# EAGLE design display-i2c (EAGLE 4.13)
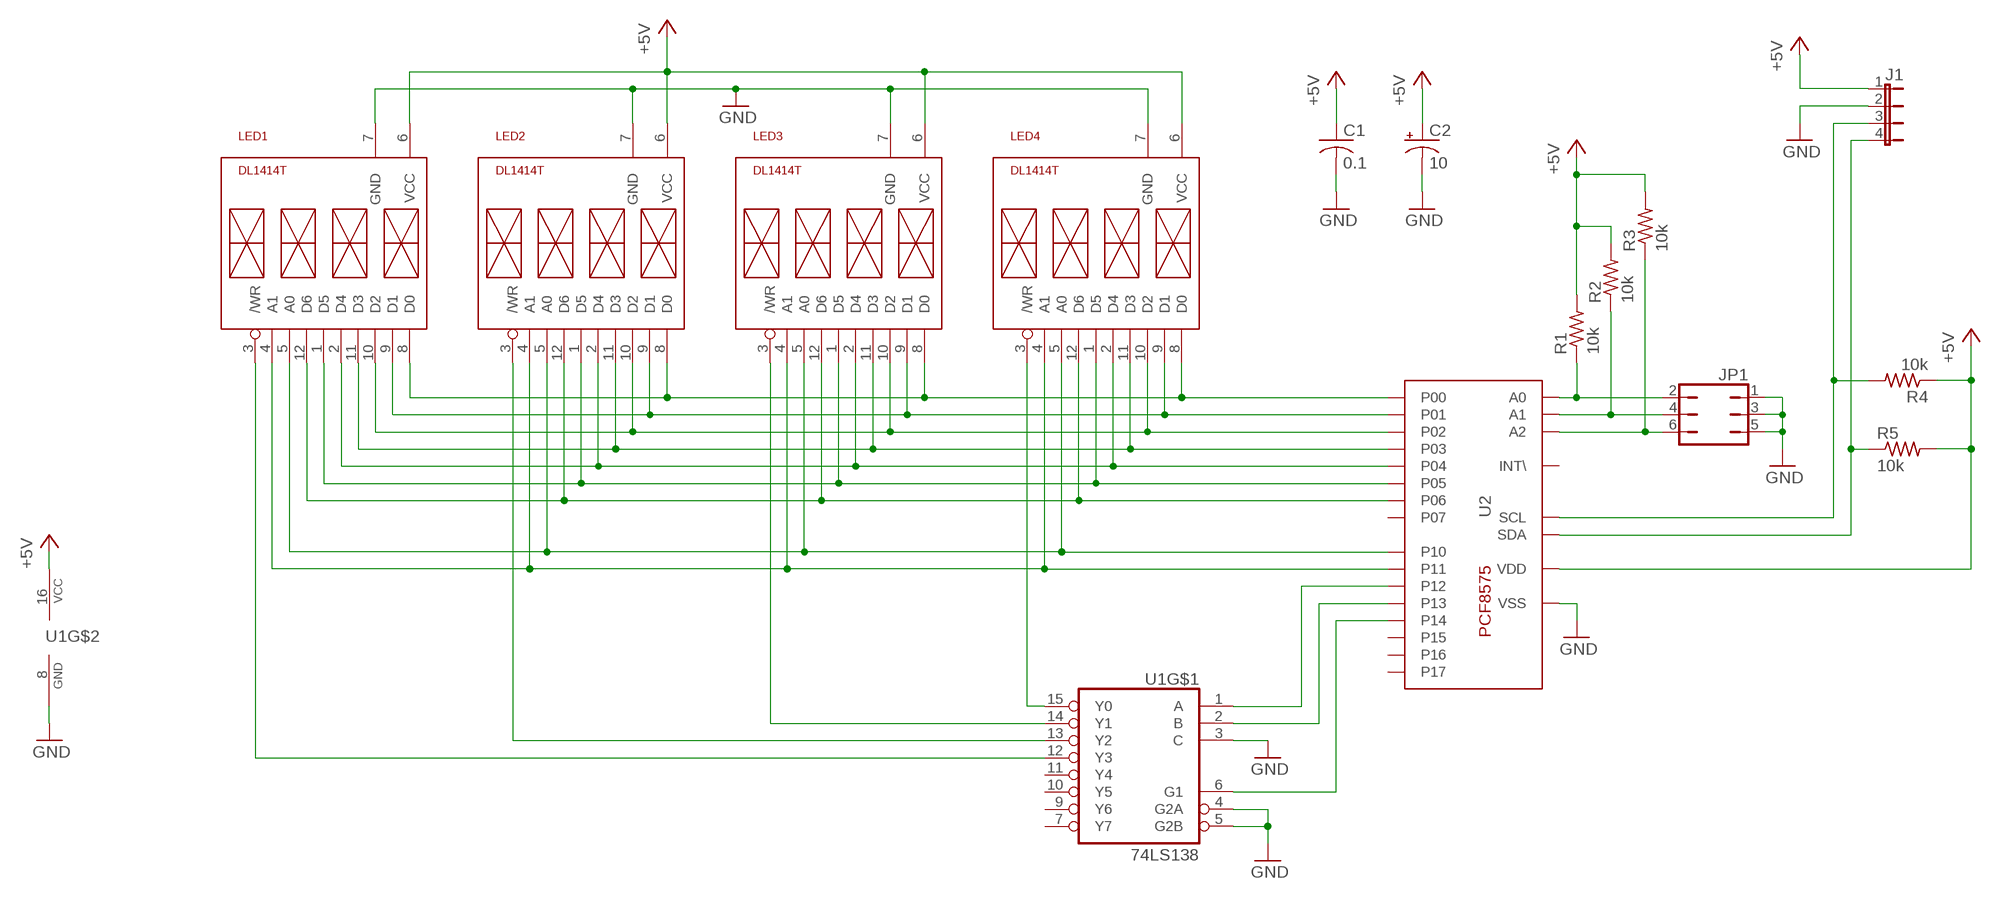
[diagram p0: schematic, sheet 1]

## Parts
C1  0.1  C-USC0603  [C0603]
C2  10  CPOL-USA/3216-18R  [A/3216-18R]
J1  JP4E  [JP4]
JP1  JP3Q  [JP3Q]
LED1  DL1414T  DL1414  [DIL12/6]
LED2  DL1414T  DL1414  [DIL12/6]
LED3  DL1414T  DL1414  [DIL12/6]
LED4  DL1414T  DL1414  [DIL12/6]
R1  10k  R-US_R0603  [R0603]
R2  10k  R-US_R0603  [R0603]
R3  10k  R-US_R0603  [R0603]
R4  10k  R-US_R0603  [R0603]
R5  10k  R-US_R0603  [R0603]
U1  74LS138  [SO16]
U2  PCF8575C  [SOP24]

## Nets
+5V: C1.1 C2.+ J1.1 LED1.6(VCC) LED2.6(VCC) LED3.6(VCC) LED4.6(VCC) R1.2 R2.2 R3.2 R4.1 R5.2 U1.16(VCC) U2.P$24(VDD)
GND: C1.2 C2.- J1.2 JP1.1 JP1.3 JP1.5 LED1.7(GND) LED2.7(GND) LED3.7(GND) LED4.7(GND) U1.3(C) U1.4(G2A) U1.5(G2B) U1.8(GND) U2.P$12(VSS)
N$1: LED1.8(D0) LED2.8(D0) LED3.8(D0) LED4.8(D0) U2.P$4(P00)
N$2: LED1.9(D1) LED2.9(D1) LED3.9(D1) LED4.9(D1) U2.P$5(P01)
N$3: LED1.10(D2) LED2.10(D2) LED3.10(D2) LED4.10(D2) U2.P$6(P02)
N$4: LED1.11(D3) LED2.11(D3) LED3.11(D3) LED4.11(D3) U2.P$7(P03)
N$5: LED1.2(D4) LED2.2(D4) LED3.2(D4) LED4.2(D4) U2.P$8(P04)
N$6: LED1.1(D5) LED2.1(D5) LED3.1(D5) LED4.1(D5) U2.P$9(P05)
N$7: LED1.12(D6) LED2.12(D6) LED3.12(D6) LED4.12(D6) U2.P$10(P06)
N$8: LED4.3(/WR) U1.15(Y0)
N$9: LED3.3(/WR) U1.14(Y1)
N$10: LED1.3(/WR) U1.12(Y3)
N$11: LED1.5(A0) LED2.5(A0) LED3.5(A0) LED4.5(A0) U2.P$13(P10)
N$12: LED1.4(A1) LED2.4(A1) LED3.4(A1) LED4.4(A1) U2.P$14(P11)
N$13: LED2.3(/WR) U1.13(Y2)
N$14: U1.1(A) U2.P$15(P12)
N$15: U1.2(B) U2.P$16(P13)
N$16: U1.6(G1) U2.P$17(P14)
N$17: J1.3 R4.2 U2.P$22(SCL)
N$18: J1.4 R5.1 U2.P$23(SDA)
N$20: JP1.2 R1.1 U2.P$21(A0)
N$21: JP1.4 R2.1 U2.P$2(A1)
N$22: JP1.6 R3.1 U2.P$3(A2)
Unconnected: U1.7(Y7) U1.9(Y6) U1.10(Y5) U1.11(Y4) U2.P$1(INT\) U2.P$11(P07) U2.P$18(P15) U2.P$19(P16) U2.P$20(P17)

## Library data of the parts
C1 = rcl:C-US: CAPACITOR, American symbol
C2 = rcl:CPOL-US: POLARIZED CAPACITOR, American symbol
J1 = jumper:JP4E: JUMPER
JP1 = jumper:JP3Q: JUMPER
LED1-LED4 = zawada:DL1414: 16-segment intelligent LED display
R1-R5 = rcl:R-US_: RESISTOR, American symbol
U1 = zawada:74LS138
U2 = pcf8575c:PCF8575C

## Board
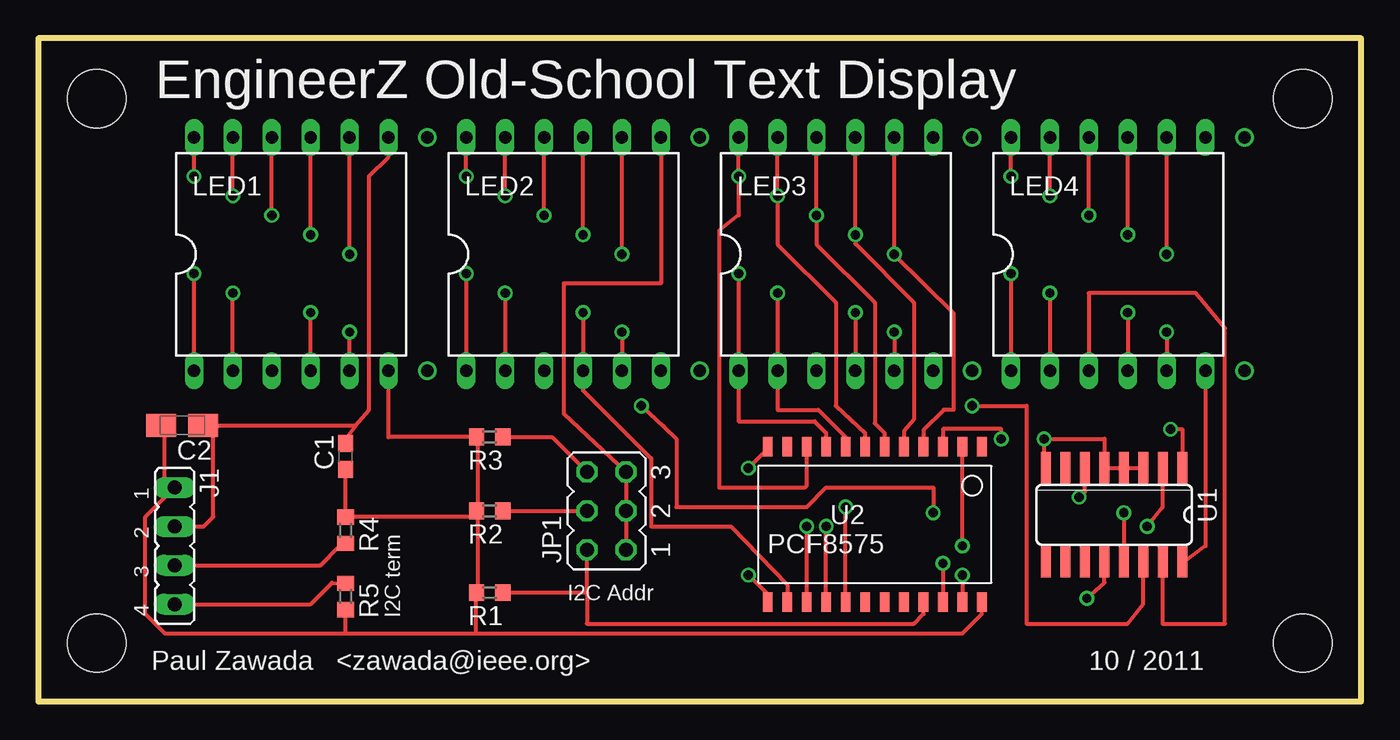
[diagram p1: board, top side]
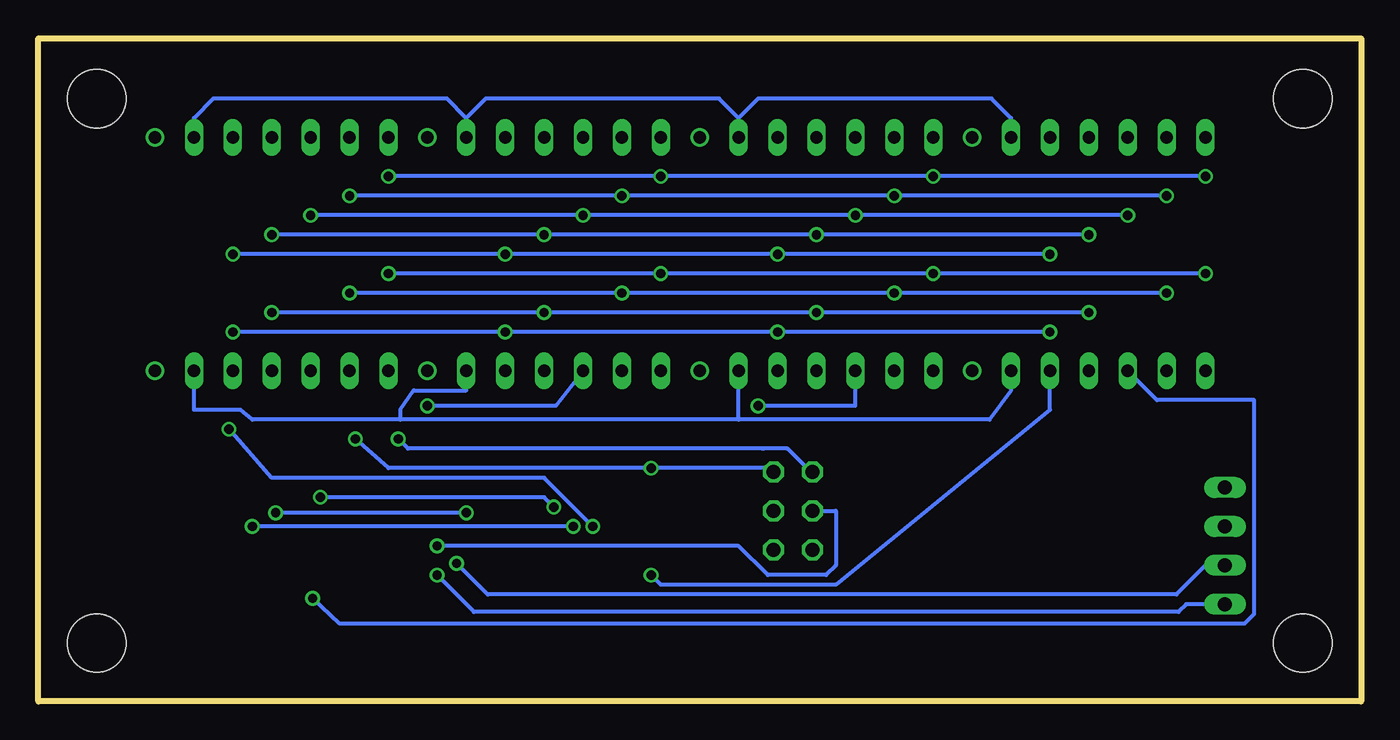
[diagram p2: board, bottom side, seen from below]

Size 86.36 x 43.31 mm. Coordinates in mm from the lower left corner, seen from the top.
Outline: 0,0 86.36,0 86.36,43.31 0,43.31 0,0
Copper layers (1*16): Top 0.0356mm / dielectric 1.5011mm / Bottom 0.0356mm
Design rules "LaenPCBOrder": minimum track width 6mil, minimum drill 13mil, track to track 6mil, track to pad 6mil, pad to pad 6mil, via to via 6mil, smd to smd 6mil, copper to edge 15mil, drill to drill 6mil, minimum pad ring 7mil, minimum via ring 7mil, stop-mask expansion 4mil, vias tented up to drill 0mil, thermal gap 10mil
Holes 3.8 mm at 3.81,39.37 3.81,3.81 82.55,39.37 82.55,3.81

### Footprints (pad centres in the part's own frame; a part is rotated, then mirrored left to right if it is on the bottom)
C0603 = smd 1.1 x 1: 1 -0.85,0; 2 0.85,0
A/3216-18R = smd 1.95 x 1.5: + 1.375,0; - -1.375,0
JP4 = drill 0.914 long: 1 -3.81,0; 2 -1.27,0; 3 1.27,0; 4 3.81,0
JP3Q = drill 0.914 octagon: 1 -2.54,-1.27; 2 -2.54,1.27; 3 0,-1.27; 4 0,1.27; 5 2.54,-1.27; 6 2.54,1.27
DIL12/6 = drill 0.813 long: 1 -6.35,-7.62; 2 -3.81,-7.62; 3 -1.27,-7.62; 4 1.27,-7.62; 5 3.81,-7.62; 6 6.35,-7.62; 7 6.35,7.62; 8 3.81,7.62; 9 1.27,7.62; 10 -1.27,7.62; 11 -3.81,7.62; 12 -6.35,7.62
R0603 = smd 1 x 1.1: 1 -0.85,0; 2 0.85,0
SO16 = smd 0.66 x 2.032: 1 -3.81,-3.073; 2 -2.54,-3.073; 3 -1.27,-3.073; 4 0,-3.073; 5 1.27,-3.073; 6 2.54,-3.073; 7 3.81,-3.073; 8 5.08,-3.073; 9 5.08,3.073; 10 3.81,3.073; 11 2.54,3.073; 12 1.27,3.073; 13 0,3.073; 14 -1.27,3.073; 15 -2.54,3.073; 16 -3.81,3.073
SOP24 = smd 1.27 x 0.635: P$1 -1.27,14.605; P$2 -1.27,13.335; P$3 -1.27,12.065; P$4 -1.27,10.795; P$5 -1.27,9.525; P$6 -1.27,8.255; P$7 -1.27,6.985; P$8 -1.27,5.715; P$9 -1.27,4.445; P$10 -1.27,3.175; P$11 -1.27,1.905; P$12 -1.27,0.635; P$13 8.89,0.635; P$14 8.89,1.905; P$15 8.89,3.175; P$16 8.89,4.445; P$17 8.89,5.715; P$18 8.89,6.985; P$19 8.89,8.255; P$20 8.89,9.525; P$21 8.89,10.795; P$22 8.89,12.065; P$23 8.89,13.335; P$24 8.89,14.605

### Placement (x,y rotation side)
C1  20.07,16 90 top
C2  9.4,18.03 180 top
J1  8.89,10.16 270 top
JP1  37.08,12.45 90 top
LED1  16.51,29.21 0 top
LED2  34.29,29.21 0 top
LED3  52.07,29.21 0 top
LED4  69.85,29.21 0 top
R1  29.46,7.11 180 top
R2  29.46,12.45 180 top
R3  29.46,17.27 180 top
R4  20.07,11.18 270 top
R5  20.07,6.86 270 top
U1  70.87,12.19 180 top
U2  46.99,15.37 270 top

### Tracks (layer width: path | path; a pad name or v marks a point on that pad's centre or on a via)
+5V
  Top 0.254: 22.86,21.72 LED1.6 22.86,17.27 R3.2 28.7,17.18 28.7,12.36 | 28.7,12.36 28.7,12.32 | 28.7,12.36 R2.2 28.57,12.06 20.32,12.06 R4.1 C1.1 | 28.7,12.36 28.7,7.2 R1.2 28.57,6.99 28.57,4.45 | 20.07,4.45 28.57,4.45 | 28.57,4.45 60.33,4.45 61.59,5.71 U2.P$24 | U1.16 74.68,9.02 76.2,10.16 LED4.6 | 20.07,4.45 8.26,4.45 6.99,5.71 6.99,12.06 J1.1 8.26,14.61 8.26,17.78 C2.+ | 20.07,4.45 R5.2
  Bottom 0.254: LED1.6 22.86,20.32 24.26,18.41 40.64,18.41 | 40.64,18.41 LED2.6 | 40.64,18.41 62.74,18.41 | LED3.6 58.42,20.32 61.85,20.32 62.74,19.05 62.74,18.41 | 62.74,18.41 72.39,18.41 73.15,19.05 76.2,19.05 LED4.6
GND  (via drill 0.61)
  Top 0.254: LED2.7 40.64,27.3 34.29,27.3 34.29,18.8 JP1.5 JP1.3 JP1.1 | U1.8 65.66,15.88 v65.66,17.14 69.6,17.14 U1.5 69.85,15.24 70.87,15.24 | 70.87,15.24 72.14,15.24 U1.3 | 70.87,15.24 U1.4 | v46.35,15.24 47.62,16.51 U2.P$12 | LED1.7 22.86,35.56 21.59,34.29 21.59,19.05 20.7,18.03 | 20.7,18.03 20.07,17.14 C1.2 | 11.43,18.03 20.7,18.03 | 10.67,18.03 C2.- 11.43,18.03 | 11.43,18.03 11.43,12.06 10.79,11.43 J1.2
  Bottom 0.254: LED1.7 22.86,38.1 24.13,39.37 39.37,39.37 40.64,38.1 | 40.64,38.1 LED2.7 | 40.64,38.1 41.91,39.37 57.15,39.37 58.42,38.1 | 58.42,38.1 LED3.7 | 58.42,38.1 59.69,39.37 74.93,39.37 76.2,38.1 LED4.7 | JP1.5 38.73,15.24 v46.35,15.24 63.5,15.24 v65.66,17.14
N$1  (via drill 0.61)
  Top 0.254: v20.32,29.21 LED1.8 | v73.66,29.21 LED4.8 | LED3.8 v55.88,29.21 55.85,29.21 55.85,29.18 59.74,25.35 59.74,19.05 59.11,19.05 57.78,17.73 U2.P$4 | v38.1,29.21 LED2.8
  Bottom 0.254: v20.32,29.21 v38.1,29.21 v55.88,29.21 v73.66,29.21
N$2  (via drill 0.61)
  Top 0.254: v17.78,30.48 LED1.9 | v71.12,30.48 LED4.9 | v35.56,30.48 LED2.9 | 53.34,30.33 53.34,30.23 | LED3.9 v53.34,30.48 53.34,30.33 | U2.P$5 56.52,17.65 57.15,18.41 57.15,26.04 53.34,29.9 53.34,30.33
  Bottom 0.254: v17.78,30.48 v35.56,30.48 v53.34,30.48 v71.12,30.48
N$3  (via drill 0.61)
  Top 0.254: v15.24,31.75 LED1.10 | v68.58,31.75 LED4.10 | LED3.10 v50.8,31.75 50.8,29.84 54.61,26.04 54.61,18.16 55.24,17.53 U2.P$6 | v33.02,31.75 LED2.10
  Bottom 0.254: v15.24,31.75 v33.02,31.75 v50.8,31.75 v68.58,31.75
N$4  (via drill 0.61)
  Top 0.254: v12.7,33.02 LED1.11 | v66.04,33.02 LED4.11 | LED3.11 v48.26,33.02 48.26,29.84 52.07,26.04 52.07,19.3 53.98,17.53 U2.P$7 | v30.48,33.02 LED2.11
  Bottom 0.254: v12.7,33.02 v30.48,33.02 v48.26,33.02 v66.04,33.02
N$5  (via drill 0.61)
  Top 0.254: LED1.2 v12.7,26.67 | v66.04,26.67 LED4.2 | v30.48,26.67 LED2.2 | v48.26,26.67 LED3.2 48.26,19.05 50.93,19.05 52.7,17.27 U2.P$8
  Bottom 0.254: v12.7,26.67 v30.48,26.67 v48.26,26.67 v66.04,26.67
N$6  (via drill 0.61)
  Top 0.254: LED1.1 v10.16,27.94 | v63.5,27.94 LED4.1 | v45.72,27.94 LED3.1 45.72,18.29 50.67,18.29 51.44,17.53 U2.P$9 | v27.94,27.94 LED2.1
  Bottom 0.254: v10.16,27.94 v27.94,27.94 v45.72,27.94 v63.5,27.94
N$7  (via drill 0.61)
  Top 0.254: v10.16,34.29 LED1.12 | 63.5,34.04 v63.5,34.29 LED4.12 | LED3.12 v45.72,34.29 45.72,31.75 44.45,30.73 44.45,13.97 50.04,13.97 50.16,14.1 U2.P$10 | v27.94,34.29 LED2.12
  Bottom 0.254: v10.16,34.29 v27.94,34.29 v45.72,34.29 v63.5,34.29
N$8
  Top 0.254: LED4.3 68.58,26.67 75.56,26.67 77.47,24.38 77.47,5.08 73.41,5.08 U1.15 73.41,9.14
N$9  (via drill 0.61)
  Top 0.254: v60.96,19.3 64.52,19.3 64.52,5.08 71.12,5.08 72.14,6.35 U1.14
  Bottom 0.254: v60.96,19.3 52.58,19.3 LED3.3
N$10  (via drill 0.61)
  Top 0.254: v68.45,6.73 69.6,7.75 U1.12
  Bottom 0.254: v68.45,6.73 66.67,5.08 7.62,5.08 6.99,5.71 6.99,19.68 13.34,19.68 LED1.3
N$11  (via drill 0.61)
  Top 0.254: LED1.5 v20.32,24.13 | v38.1,24.13 LED2.5 | v55.88,24.13 LED3.5 | 73.66,24.38 v73.66,24.13 LED4.5 | v46.35,8.26 47.62,6.99 U2.P$13
  Bottom 0.254: v20.32,24.13 v38.1,24.13 v55.88,24.13 v73.66,24.13 | v46.35,8.26 45.72,7.62 34.29,7.62 20.32,19.05 LED1.5
N$12  (via drill 0.61)
  Top 0.254: LED1.4 v17.78,25.4 | v35.56,25.4 LED2.4 35.56,20.32 40.01,15.88 40.01,11.43 45.21,11.43 48.9,7.62 U2.P$14 | v53.34,25.4 LED3.4 | 71.12,21.34 LED4.4 v71.12,25.4
  Bottom 0.254: v17.78,25.4 v35.56,25.4 v53.34,25.4 v71.12,25.4
N$13  (via drill 0.61)
  Top 0.254: v70.87,12.32 U1.13 | v58.42,12.32 58.42,13.97 51.44,13.97 50.16,12.7 41.66,12.7 41.66,17.14 40.82,17.96 v39.37,19.3
  Bottom 0.254: v58.42,12.32 v70.87,12.32 | v39.37,19.3 33.02,19.3 LED2.3
N$14  (via drill 0.61)
  Top 0.254: v73.91,17.78 74.68,17.78 U1.1 | U2.P$15 v50.16,11.43
  Bottom 0.254: v50.16,11.43 53.34,14.61 71.12,14.61 v73.91,17.78
N$15  (via drill 0.61)
  Top 0.254: v72.39,11.43 73.41,12.7 U1.2 | U2.P$16 v51.44,11.43
  Bottom 0.254: v51.44,11.43 v72.39,11.43
N$16  (via drill 0.61)
  Top 0.254: v67.94,13.34 68.33,13.72 U1.6 | U2.P$17 v52.7,12.7
  Bottom 0.254: v52.7,12.7 53.34,13.34 v67.94,13.34
N$17  (via drill 0.61)
  Top 0.254: 10.16,8.89 J1.3 18.41,8.89 19.68,10.16 R4.2 | v59.05,9.02 U2.P$22
  Bottom 0.254: v59.05,9.02 57.02,6.99 12.06,6.99 10.16,8.89 J1.3
N$18  (via drill 0.61)
  Top 0.254: R5.1 19.18,7.75 17.78,6.35 J1.4 10.16,6.35 | v60.33,8.26 U2.P$23
  Bottom 0.254: J1.4 11.43,6.35 11.94,5.84 57.91,5.84 v60.33,8.26
N$19  (via drill 0.8 pad 0.81)
  other vias: 78.74,21.59 78.74,36.83 60.96,36.83 25.4,36.83 25.4,21.59 43.18,21.59 43.18,36.83 60.96,21.59
N$20
  Top 0.254: R1.1 35.81,7.11 | 35.81,7.11 JP1.2 | 35.81,7.11 35.81,5.08 57.15,5.08 57.78,5.71 U2.P$21
N$21  (via drill 0.61)
  Top 0.254: R2.1 JP1.4 | v60.33,10.16 U2.P$2
  Bottom 0.254: v60.33,10.16 40.64,10.16 38.73,8.26 34.92,8.26 34.29,8.89 34.29,12.45 JP1.4
N$22  (via drill 0.61)
  Top 0.254: 30.23,17.27 R3.1 33.53,17.27 JP1.6 | v62.87,17.14 62.87,17.78 59.05,17.78 U2.P$3
  Bottom 0.254: v62.87,17.14 62.23,16.51 38.99,16.51 | 38.99,16.51 37.47,16.51 36.2,15.24 JP1.6 | 38.99,16.51 39.12,16.51

### Text on the board
tNames: EngineerZ Old-School Text Display | I2C term | I2C Addr | Paul Zawada <zawada@ieee.org> | 10 / 2011
tValues: +5V | GND | SCL | SDA